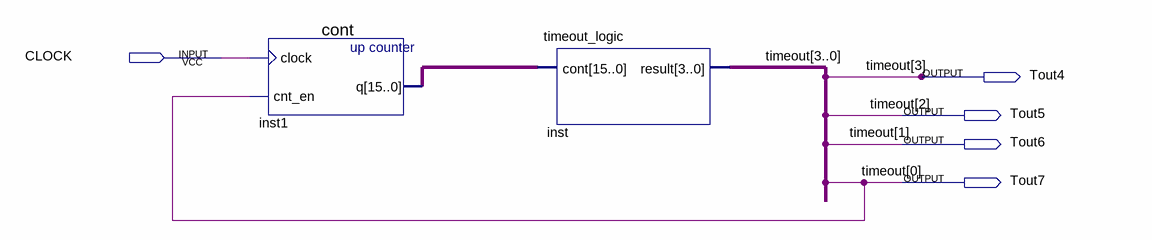
[diagram p0: schematic sheet]
// Quartus schematic timeoutTest.bdf as structural Verilog: 2 symbols, 5 pins
module timeoutTest (
  input  CLOCK,
  output Tout4,
  output Tout5,
  output Tout6,
  output Tout7
);

  wire [15:0] inst1_q;

  cont inst1 (.clock(CLOCK), .cnt_en(Tout7), .q(inst1_q));
  timeout_logic inst (.cont(inst1_q), .result({Tout4, Tout5, Tout6, Tout7}));

  // Other names for the same wires on the sheet: timeout[3:0] = {Tout4, Tout5, Tout6, Tout7}
endmodule
